# Altium project bat_pak_reva.PrjPcb
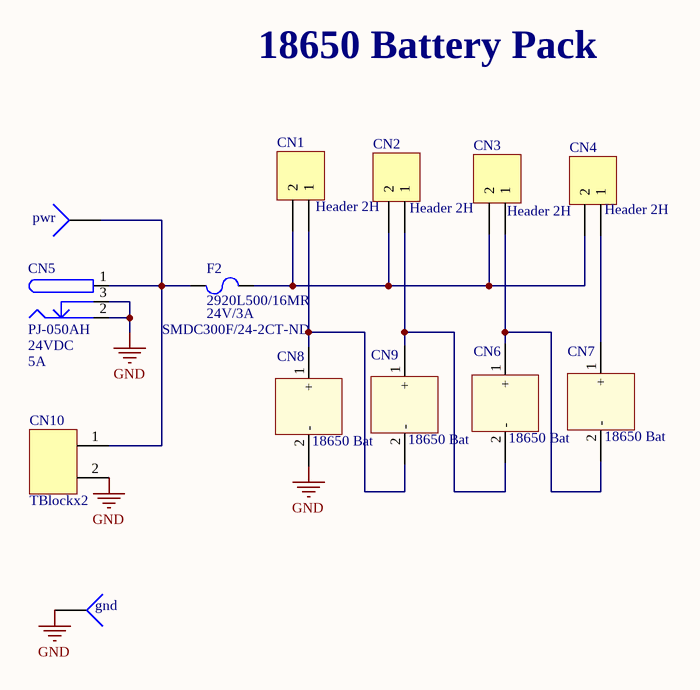
[diagram p0: bat_pak_reva.SchDoc]
1 sheet, 13 parts. Net scope: global (net labels, ports and power ports of the same name join across sheets).
Board file: bat_pak_reva.PcbDoc

## Sheet bat_pak_reva.SchDoc: battery_pack
size B; Author: JO; DrawnBy: JO; Engineer: JO; DocumentNumber: 091117; Revision: A; SheetNumber: 1; SheetTotal: 1; PageSetup: Record=PageOptions|CenterHorizontal=True|CenterVertical=True|PrintScale=0.95|XCorrection=1.00|YCorrection=1.00|PrintKind=1|BorderSize=5000000|LeftOffset=0|BottomOffset=0|Orientation=2|PaperLength=1000|PaperWidth=1000|Scale=100|PaperSource=7|PrintQuality=-4|MediaType=1|DitherType=10|PaperKind=Letter|PrintScaleMode=1; DocumentName: HDMI  KD101N9

### Parts
CN1  Header 2H  [HDR1X2H]
CN2  Header 2H  [HDR1X2H]
CN3  Header 2H  [HDR1X2H]
CN4  Header 2H  [HDR1X2H]
CN5  PJ-050AH  Voltage - Rated: 24VDC  Current Rating: 5A  [PJ-050AH]
CN6  18650 Bat  [battery_holder_18650]
CN7  18650 Bat  [battery_holder_18650]
CN8  18650 Bat  [battery_holder_18650]
CN9  18650 Bat  [battery_holder_18650]
CN10  TBlockx2  [TB-5MM-X2]
F2  2920L500/16MR  [2920 Fuse]
gnd  (no value)  [TestPoint-TH 35 mil]  (no BOM)
pwr  (no value)  [TestPoint-TH 35 mil]  (no BOM)

### Nets
GND: CN5.2 CN5.3 CN8.2(-) CN10.2 gnd.1
NetCN1_1: CN1.1 CN8.1(+) CN9.2(-)
NetCN1_2: CN1.2 CN2.2 CN3.2 CN4.2 F2.2
NetCN2_1: CN2.1 CN6.2(-) CN9.1(+)
NetCN3_1: CN3.1 CN6.1(+) CN7.2(-)
NetCN4_1: CN4.1 CN7.1(+)
NetCN5_1: CN5.1 CN10.1 F2.1 pwr.1

### Notes on the sheet
- 18650 Battery Pack
- SMDC300F/24-2CT-ND
- (near F2) 24V/3A
- Title
- By:
- Date:
- Number:
- Time:
- Revision:
- Sheet
- of
- OLogic, Inc.
- 3350 Scott Blvd. Bldg 47
- Santa Clara, CA
- 95054 USA
- File:
- (650) 996-1490

### Library data of the parts
CN1-CN4 = CMP-001-0287-01: Header, 2-Pin, Right Angle; Manufacturer Part Number: M20-9960245; Manufacturer: Harwin Inc.; Mated Stacking Heights: 11.72mm, 12.62mm, 12.72mm, 13.62mm, 18.22mm, 19.12mm; Style: Board to Board or Cable; Number of Positions Loaded: All; Signal Integrity: Connector; Number of Positions: 2; Current Rating: 3A per Contact; Shrouding: Unshrouded; Contact Length - Post: 0.118" (3.00mm); Connector Type: Header, Cuttable; Contact Length - Mating: 0.240" (6.10mm); Material Flammability Rating: UL94 V-0; Pitch - Mating: 0.100" (2.54mm); Part Status: Active; Designator: Header 2H; Packaging: Bulk; Contact Finish - Post: -; Contact Material: Brass; Publisher: Altium Limited; Applications: -; Insulation Height: 0.100" (2.54mm); Number of Rows: 1; Ingress Protection: -; Pricing 1: 1=0.15, 10=0.141, 100=0.087, 500=0.072, 1000=0.063, 5000=0.054, 10000=0.0525 (USD); Contact Finish - Mating: Gold; Features: -; Component Name: Header 2H; Mounting Type: Through Hole, Right Angle; Overall Contact Length: -; LatestRevisionDate: 17-Jul-2002; RoHS: RoHS Compliant; Voltage Rating: -; Contact Finish Thickness - Mating: -; Contact Shape: Square; Termination: Solder; Row Spacing - Mating: -; Contact Finish Thickness - Post: -; Insulation Material: Polyamide (PA6T), Nylon 6T; Stock 1: 17504; ComponentLink1Description: https://cdn.harwin.com/pdfs/M20-996.pdf; LatestRevisionNote: Re-released for DXP Platform.; Pin Count: 2; Contact Type: Male Pin; ComponentLink1URL: https://cdn.harwin.com/pdfs/M20-996.pdf; Fastening Type: -; Operating Temperature: -40°C ~ 105°C; Insulation Color: Black
CN5 = CMP-001-0507-01: Power Barrel Connector Jack 2.00mm ID 5.50mm OD Through Hole, Right Angle; Manufacturer: CUI; Plug/Mating Plug Diameter: 2.1mm ID, 5.5mm OD; Internal Switch(s): Single Switch, Normally Closed; Shielding: Unshielded; Number of Positions/Contacts: 2 Conductors, 3 Contacts; Gender: Male; Stock 1: 4408; ComponentLink1Description: http://www.mouser.com/ds/2/670/PJ-050AH-524150.pdf; Pin Count: 3; Features: -; Housing Color: Black; Contact Material - Plating: Nickel; Termination: Solder; Mounting Type: Through Hole, Right Angle; Color: Black; Component Name: PJ-050AH; Series: -; Pricing 1: 1=0.78, 10=0.689, 25=0.648, 50=0.621, 100=0.594, 250=0.54, 500=0.486, 1000=0.432, 2500=0.3915 (USD); Housing Material: Thermoplastic; Operating Temperature: -25°C ~ 85°C; Connector Type: Jack; Contact Material: Copper; Family: Barrel - Power Connectors; ComponentLink1URL: http://www.mouser.com/ds/2/670/PJ-050AH-524150.pdf; Manufacturer Part Number: PJ-050AH; Designator: PJ-050AH
CN6-CN9 = battery_holder_18650
CN10 = CMP-001-0545-01: 5mm Terminal Block x 2; Manufacturer: OST; MPN: OSTTC020160; Vendor: Jameco; PN: 164794; Component Name: TBlockx2; Pin Count: 2; Designator: TBlockx2
F2 = CMP-001-0852-01: PTC RESET FUSE 16V 5A 2920; Max Power Dissipation: 2W; Max Current Rating: 40A; Time to Trip: 5s; Trip Current: 10A; Height: 1.6mm; Voltage Rating (DC): 16V; Case/Package: 2920; Length: 7.98mm; Case Code (Imperial): 2920; Packaging: Tape and Reel; Width: 5.44mm; Package Quantity: 1; Max Operating Temperature: 85°C; Hold Current: 5A; REACH SVHC: No SVHC; Lead Free: Lead Free; Case Code (Metric): 7351; Min Operating Temperature: -40°C; Termination: SMD/SMT
gnd pwr = TestPoint: Test Point